# EAGLE board untitled (EAGLE 9.6.2), part 1 of 2
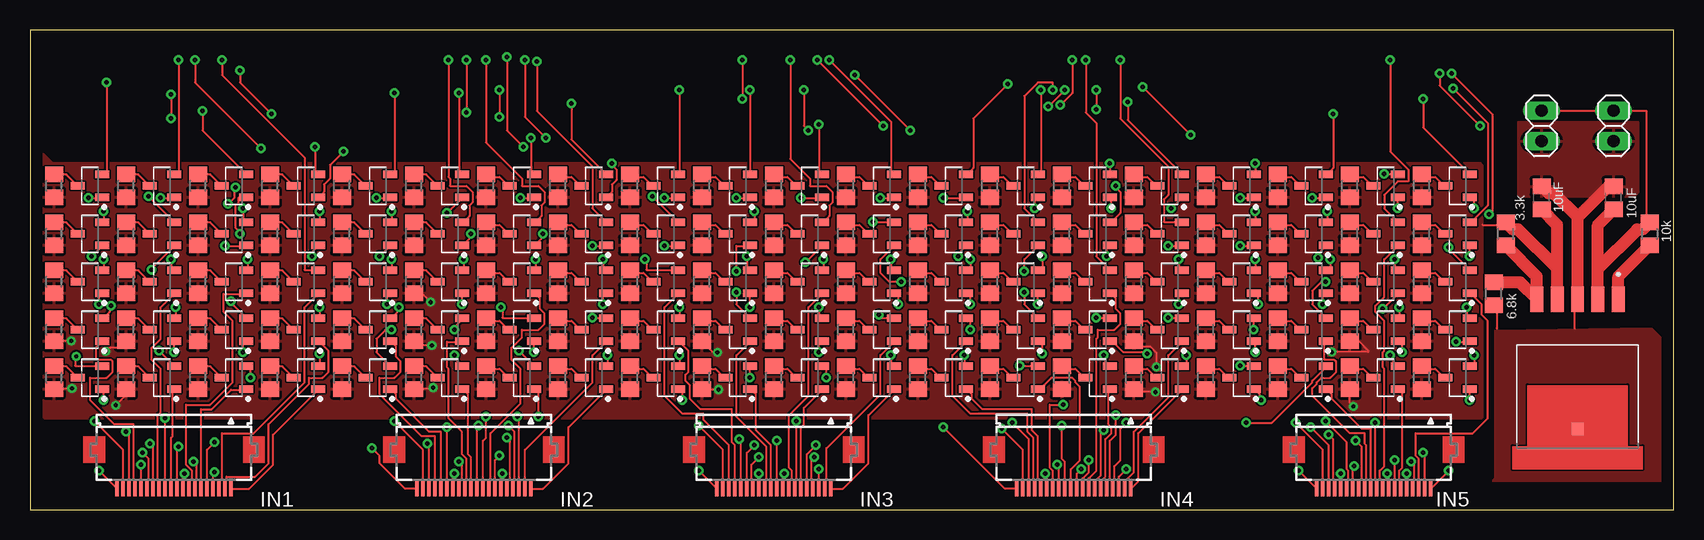
[diagram p1: board, top side]
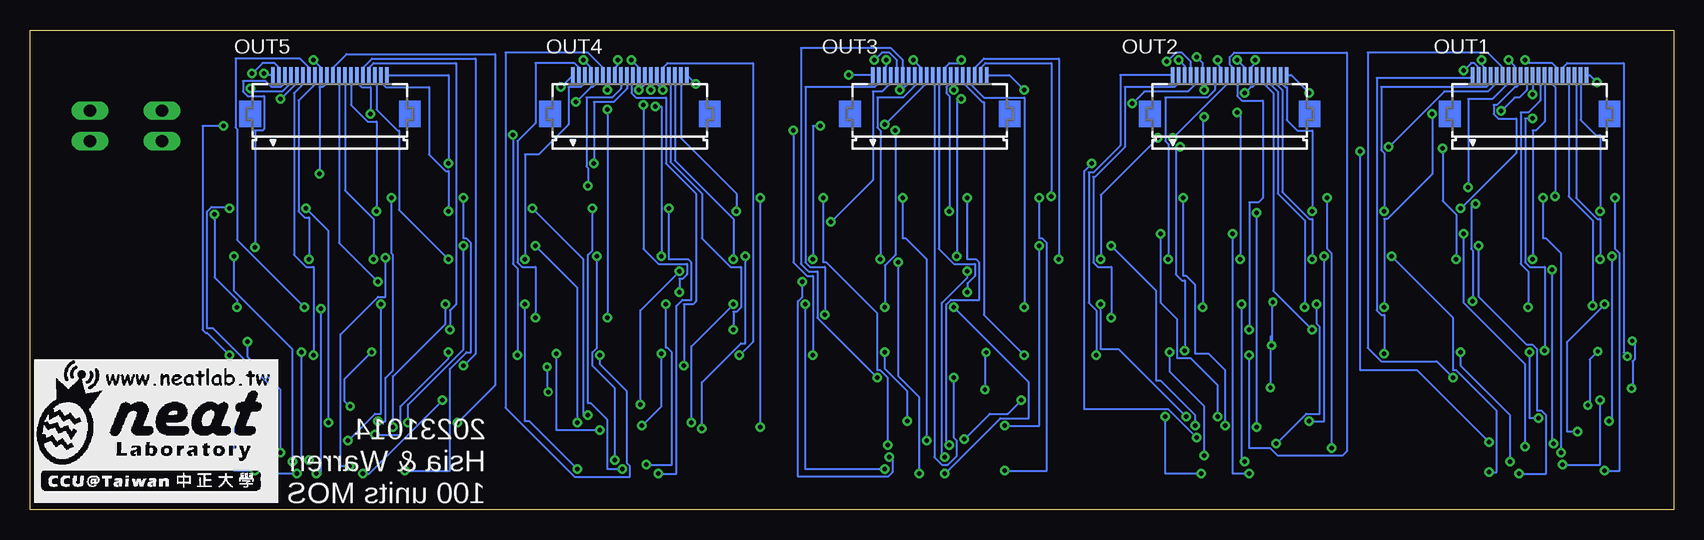
[diagram p2: board, bottom side, seen from below]

Size 137 x 40 mm. Coordinates in mm from the lower left corner, seen from the top.
Outline: 0,0 137,0 137,40 0,40 0,0
Copper layers (1*16): Top 0.035mm / dielectric 1.5mm / Bottom 0.035mm
Design rules "default": minimum track width 6mil, minimum drill 0.35mm, track to track 6mil, track to pad 6mil, pad to pad 6mil, via to via 6mil, smd to smd 6mil, copper to edge 40mil, drill to drill 6mil, minimum pad ring 10mil, minimum via ring 8mil, stop-mask expansion 4mil, vias tented up to drill 0mil, thermal gap 10mil

## Footprints (pad centres in the part's own frame; a part is rotated, then mirrored left to right if it is on the bottom)
FH12-20S-0.5SH = smd 0.3 x 1.3: 1 -4.75,3.25; 2 -4.25,3.25; 3 -3.75,3.25; 4 -3.25,3.25; 5 -2.75,3.25; 6 -2.25,3.25; 7 -1.75,3.25; 8 -1.25,3.25; 9 -0.75,3.25; 10 -0.25,3.25; 11 0.25,3.25; 12 0.75,3.25; 13 1.25,3.25; 14 1.75,3.25; 15 2.25,3.25; 16 2.75,3.25; 17 3.25,3.25; 18 3.75,3.25; 19 4.25,3.25; 20 4.75,3.25
1X02 = drill 1.016 long: 1 -1.27,0; 2 1.27,0
LP38501TS_ADJ = smd 2.16 x 1.07: ADJ -6.545,-3.4; EN -6.545,3.4; GND -6.545,0; IN -6.545,1.7; OUT -6.545,-1.7 | smd 1 x 1: DAP 4.255,0
C0805 = smd 1.3 x 1.5: 1 -0.95,0; 2 0.95,0
R0805 = smd 1.3 x 1.5: 1 -0.95,0; 2 0.95,0
SOT95P240X110-3N = smd 1.18 x 0.609: 1 -1.024,0.95; 2 -1.024,-0.95; 3 1.024,0

## Placement (x,y rotation side)
IN1  FH12-20S-0.5SH  [FH12-20S-0.5SH]  12,5 180 top
IN2  FH12-20S-0.5SH  [FH12-20S-0.5SH]  37,5 180 top
IN3  FH12-20S-0.5SH  [FH12-20S-0.5SH]  62,5 180 top
IN4  FH12-20S-0.5SH  [FH12-20S-0.5SH]  87,5 180 top
IN5  FH12-20S-0.5SH  [FH12-20S-0.5SH]  112,5 180 top
JP1  [1X02]  126,32 270 top
JP2  [1X02]  132,32 270 top
LDO  [LP38501TS_ADJ]  129,11 270 top
LDO_C1  10uF  [C0805]  132,26 90 top
LDO_C2  10uF  [C0805]  126,26 90 top
LDO_R1  3.3k  [R0805]  123,23 90 top
LDO_R2  6.8k  [R0805]  122,18 90 top
LDO_R3  10k  [R0805]  135,23 270 top
MOS1  NX6008NBKNX6008NBK  [SOT95P240X110-3N]  23,11 180 top
MOS2  NX6008NBKNX6008NBK  [SOT95P240X110-3N]  23,15 180 top
MOS3  NX6008NBKNX6008NBK  [SOT95P240X110-3N]  23,19 180 top
MOS4  NX6008NBKNX6008NBK  [SOT95P240X110-3N]  23,23 180 top
MOS5  NX6008NBKNX6008NBK  [SOT95P240X110-3N]  23,27 180 top
MOS6  NX6008NBKNX6008NBK  [SOT95P240X110-3N]  17,11 180 top
MOS7  NX6008NBKNX6008NBK  [SOT95P240X110-3N]  17,15 180 top
MOS8  NX6008NBKNX6008NBK  [SOT95P240X110-3N]  17,19 180 top
MOS9  NX6008NBKNX6008NBK  [SOT95P240X110-3N]  17,23 180 top
MOS10  NX6008NBKNX6008NBK  [SOT95P240X110-3N]  17,27 180 top
MOS11  NX6008NBKNX6008NBK  [SOT95P240X110-3N]  11,11 180 top
MOS12  NX6008NBKNX6008NBK  [SOT95P240X110-3N]  11,15 180 top
MOS13  NX6008NBKNX6008NBK  [SOT95P240X110-3N]  11,19 180 top
MOS14  NX6008NBKNX6008NBK  [SOT95P240X110-3N]  11,23 180 top
MOS15  NX6008NBKNX6008NBK  [SOT95P240X110-3N]  11,27 180 top
MOS16  NX6008NBKNX6008NBK  [SOT95P240X110-3N]  5,11 180 top
MOS17  NX6008NBKNX6008NBK  [SOT95P240X110-3N]  5,15 180 top
MOS18  NX6008NBKNX6008NBK  [SOT95P240X110-3N]  5,19 180 top
MOS19  NX6008NBKNX6008NBK  [SOT95P240X110-3N]  5,23 180 top
MOS20  NX6008NBKNX6008NBK  [SOT95P240X110-3N]  5,27 180 top
MOS21  NX6008NBKNX6008NBK  [SOT95P240X110-3N]  47,11 180 top
MOS22  NX6008NBKNX6008NBK  [SOT95P240X110-3N]  47,15 180 top
MOS23  NX6008NBKNX6008NBK  [SOT95P240X110-3N]  47,19 180 top
MOS24  NX6008NBKNX6008NBK  [SOT95P240X110-3N]  47,23 180 top
MOS25  NX6008NBKNX6008NBK  [SOT95P240X110-3N]  47,27 180 top
MOS26  NX6008NBKNX6008NBK  [SOT95P240X110-3N]  41,11 180 top
MOS27  NX6008NBKNX6008NBK  [SOT95P240X110-3N]  41,15 180 top
MOS28  NX6008NBKNX6008NBK  [SOT95P240X110-3N]  41,19 180 top
MOS29  NX6008NBKNX6008NBK  [SOT95P240X110-3N]  41,23 180 top
MOS30  NX6008NBKNX6008NBK  [SOT95P240X110-3N]  41,27 180 top
MOS31  NX6008NBKNX6008NBK  [SOT95P240X110-3N]  35,11 180 top
MOS32  NX6008NBKNX6008NBK  [SOT95P240X110-3N]  35,15 180 top
MOS33  NX6008NBKNX6008NBK  [SOT95P240X110-3N]  35,19 180 top
MOS34  NX6008NBKNX6008NBK  [SOT95P240X110-3N]  35,23 180 top
MOS35  NX6008NBKNX6008NBK  [SOT95P240X110-3N]  35,27 180 top
MOS36  NX6008NBKNX6008NBK  [SOT95P240X110-3N]  29,11 180 top
MOS37  NX6008NBKNX6008NBK  [SOT95P240X110-3N]  29,15 180 top
MOS38  NX6008NBKNX6008NBK  [SOT95P240X110-3N]  29,19 180 top
MOS39  NX6008NBKNX6008NBK  [SOT95P240X110-3N]  29,23 180 top
MOS40  NX6008NBKNX6008NBK  [SOT95P240X110-3N]  29,27 180 top
MOS41  NX6008NBKNX6008NBK  [SOT95P240X110-3N]  71,11 180 top
MOS42  NX6008NBKNX6008NBK  [SOT95P240X110-3N]  71,15 180 top
MOS43  NX6008NBKNX6008NBK  [SOT95P240X110-3N]  71,19 180 top
MOS44  NX6008NBKNX6008NBK  [SOT95P240X110-3N]  71,23 180 top
MOS45  NX6008NBKNX6008NBK  [SOT95P240X110-3N]  71,27 180 top
MOS46  NX6008NBKNX6008NBK  [SOT95P240X110-3N]  65,11 180 top
MOS47  NX6008NBKNX6008NBK  [SOT95P240X110-3N]  65,15 180 top
MOS48  NX6008NBKNX6008NBK  [SOT95P240X110-3N]  65,19 180 top
MOS49  NX6008NBKNX6008NBK  [SOT95P240X110-3N]  65,23 180 top
MOS50  NX6008NBKNX6008NBK  [SOT95P240X110-3N]  65,27 180 top
MOS51  NX6008NBKNX6008NBK  [SOT95P240X110-3N]  59,11 180 top
MOS52  NX6008NBKNX6008NBK  [SOT95P240X110-3N]  59,15 180 top
MOS53  NX6008NBKNX6008NBK  [SOT95P240X110-3N]  59,19 180 top
MOS54  NX6008NBKNX6008NBK  [SOT95P240X110-3N]  59,23 180 top
MOS55  NX6008NBKNX6008NBK  [SOT95P240X110-3N]  59,27 180 top
MOS56  NX6008NBKNX6008NBK  [SOT95P240X110-3N]  53,11 180 top
MOS57  NX6008NBKNX6008NBK  [SOT95P240X110-3N]  53,15 180 top
MOS58  NX6008NBKNX6008NBK  [SOT95P240X110-3N]  53,19 180 top
MOS59  NX6008NBKNX6008NBK  [SOT95P240X110-3N]  53,23 180 top
MOS60  NX6008NBKNX6008NBK  [SOT95P240X110-3N]  53,27 180 top
MOS61  NX6008NBKNX6008NBK  [SOT95P240X110-3N]  95,11 180 top
MOS62  NX6008NBKNX6008NBK  [SOT95P240X110-3N]  95,15 180 top
MOS63  NX6008NBKNX6008NBK  [SOT95P240X110-3N]  95,19 180 top
MOS64  NX6008NBKNX6008NBK  [SOT95P240X110-3N]  95,23 180 top
MOS65  NX6008NBKNX6008NBK  [SOT95P240X110-3N]  95,27 180 top
MOS66  NX6008NBKNX6008NBK  [SOT95P240X110-3N]  89,11 180 top
MOS67  NX6008NBKNX6008NBK  [SOT95P240X110-3N]  89,15 180 top
MOS68  NX6008NBKNX6008NBK  [SOT95P240X110-3N]  89,19 180 top
MOS69  NX6008NBKNX6008NBK  [SOT95P240X110-3N]  89,23 180 top
MOS70  NX6008NBKNX6008NBK  [SOT95P240X110-3N]  89,27 180 top
MOS71  NX6008NBKNX6008NBK  [SOT95P240X110-3N]  83,11 180 top
MOS72  NX6008NBKNX6008NBK  [SOT95P240X110-3N]  83,15 180 top
MOS73  NX6008NBKNX6008NBK  [SOT95P240X110-3N]  83,19 180 top
MOS74  NX6008NBKNX6008NBK  [SOT95P240X110-3N]  83,23 180 top
MOS75  NX6008NBKNX6008NBK  [SOT95P240X110-3N]  83,27 180 top
MOS76  NX6008NBKNX6008NBK  [SOT95P240X110-3N]  77,11 180 top
MOS77  NX6008NBKNX6008NBK  [SOT95P240X110-3N]  77,15 180 top
MOS78  NX6008NBKNX6008NBK  [SOT95P240X110-3N]  77,19 180 top
MOS79  NX6008NBKNX6008NBK  [SOT95P240X110-3N]  77,23 180 top
MOS80  NX6008NBKNX6008NBK  [SOT95P240X110-3N]  77,27 180 top
MOS81  NX6008NBKNX6008NBK  [SOT95P240X110-3N]  119,11 180 top
MOS82  NX6008NBKNX6008NBK  [SOT95P240X110-3N]  119,15 180 top
MOS83  NX6008NBKNX6008NBK  [SOT95P240X110-3N]  119,19 180 top
MOS84  NX6008NBKNX6008NBK  [SOT95P240X110-3N]  119,23 180 top
MOS85  NX6008NBKNX6008NBK  [SOT95P240X110-3N]  119,27 180 top
MOS86  NX6008NBKNX6008NBK  [SOT95P240X110-3N]  113,11 180 top
MOS87  NX6008NBKNX6008NBK  [SOT95P240X110-3N]  113,15 180 top
MOS88  NX6008NBKNX6008NBK  [SOT95P240X110-3N]  113,19 180 top
MOS89  NX6008NBKNX6008NBK  [SOT95P240X110-3N]  113,23 180 top
MOS90  NX6008NBKNX6008NBK  [SOT95P240X110-3N]  113,27 180 top
MOS91  NX6008NBKNX6008NBK  [SOT95P240X110-3N]  107,11 180 top
MOS92  NX6008NBKNX6008NBK  [SOT95P240X110-3N]  107,15 180 top
MOS93  NX6008NBKNX6008NBK  [SOT95P240X110-3N]  107,19 180 top
MOS94  NX6008NBKNX6008NBK  [SOT95P240X110-3N]  107,23 180 top
MOS95  NX6008NBKNX6008NBK  [SOT95P240X110-3N]  107,27 180 top
MOS96  NX6008NBKNX6008NBK  [SOT95P240X110-3N]  101,11 180 top
MOS97  NX6008NBKNX6008NBK  [SOT95P240X110-3N]  101,15 180 top
MOS98  NX6008NBKNX6008NBK  [SOT95P240X110-3N]  101,19 180 top
MOS99  NX6008NBKNX6008NBK  [SOT95P240X110-3N]  101,23 180 top
MOS100  NX6008NBKNX6008NBK  [SOT95P240X110-3N]  101,27 180 top
OUT1  FH12-20S-0.5SH  [FH12-20S-0.5SH]  12,33 0 bottom
OUT2  FH12-20S-0.5SH  [FH12-20S-0.5SH]  37,33 0 bottom
OUT3  FH12-20S-0.5SH  [FH12-20S-0.5SH]  62,33 0 bottom
OUT4  FH12-20S-0.5SH  [FH12-20S-0.5SH]  87,33 0 bottom
OUT5  FH12-20S-0.5SH  [FH12-20S-0.5SH]  112,33 0 bottom
R1  0  [R0805]  20,11 90 top
R2  0  [R0805]  20,15 90 top
R3  0  [R0805]  20,19 90 top
R4  0  [R0805]  20,23 90 top
R5  0  [R0805]  20,27 90 top
R6  0  [R0805]  14,11 90 top
R7  0  [R0805]  14,15 90 top
R8  0  [R0805]  14,19 90 top
R9  0  [R0805]  14,23 90 top
R10  0  [R0805]  14,27 90 top
R11  0  [R0805]  8,11 90 top
R12  0  [R0805]  8,15 90 top
R13  0  [R0805]  8,19 90 top
R14  0  [R0805]  8,23 90 top
R15  0  [R0805]  8,27 90 top
R16  0  [R0805]  2,11 90 top
R17  0  [R0805]  2,15 90 top
R18  0  [R0805]  2,19 90 top
R19  0  [R0805]  2,23 90 top
R20  0  [R0805]  2,27 90 top
R21  0  [R0805]  44,11 90 top
R22  0  [R0805]  44,15 90 top
R23  0  [R0805]  44,19 90 top
R24  0  [R0805]  44,23 90 top
R25  0  [R0805]  44,27 90 top
R26  0  [R0805]  38,11 90 top
R27  0  [R0805]  38,15 90 top
R28  0  [R0805]  38,19 90 top
R29  0  [R0805]  38,23 90 top
R30  0  [R0805]  38,27 90 top
R31  0  [R0805]  32,11 90 top
R32  0  [R0805]  32,15 90 top
R33  0  [R0805]  32,19 90 top
R34  0  [R0805]  32,23 90 top
R35  0  [R0805]  32,27 90 top
R36  0  [R0805]  26,11 90 top
R37  0  [R0805]  26,15 90 top
R38  0  [R0805]  26,19 90 top
R39  0  [R0805]  26,23 90 top
R40  0  [R0805]  26,27 90 top
R41  0  [R0805]  68,11 90 top
R42  0  [R0805]  68,15 90 top
R43  0  [R0805]  68,19 90 top
R44  0  [R0805]  68,23 90 top
R45  0  [R0805]  68,27 90 top
R46  0  [R0805]  62,11 90 top
R47  0  [R0805]  62,15 90 top
R48  0  [R0805]  62,19 90 top
R49  0  [R0805]  62,23 90 top
R50  0  [R0805]  62,27 90 top
R51  0  [R0805]  56,11 90 top
R52  0  [R0805]  56,15 90 top
R53  0  [R0805]  56,19 90 top
R54  0  [R0805]  56,23 90 top
R55  0  [R0805]  56,27 90 top
R56  0  [R0805]  50,11 90 top
R57  0  [R0805]  50,15 90 top
R58  0  [R0805]  50,19 90 top
R59  0  [R0805]  50,23 90 top
R60  0  [R0805]  50,27 90 top
R61  0  [R0805]  92,11 90 top
R62  0  [R0805]  92,15 90 top
R63  0  [R0805]  92,19 90 top
R64  0  [R0805]  92,23 90 top
R65  0  [R0805]  92,27 90 top
R66  0  [R0805]  86,11 90 top
R67  0  [R0805]  86,15 90 top
R68  0  [R0805]  86,19 90 top
R69  0  [R0805]  86,23 90 top
R70  0  [R0805]  86,27 90 top
R71  0  [R0805]  80,11 90 top
R72  0  [R0805]  80,15 90 top
R73  0  [R0805]  80,19 90 top
R74  0  [R0805]  80,23 90 top
R75  0  [R0805]  80,27 90 top
R76  0  [R0805]  74,11 90 top
R77  0  [R0805]  74,15 90 top
R78  0  [R0805]  74,19 90 top
R79  0  [R0805]  74,23 90 top
R80  0  [R0805]  74,27 90 top
R81  0  [R0805]  116,11 90 top
R82  0  [R0805]  116,15 90 top
R83  0  [R0805]  116,19 90 top
R84  0  [R0805]  116,23 90 top
R85  0  [R0805]  116,27 90 top
R86  0  [R0805]  110,11 90 top
R87  0  [R0805]  110,15 90 top
R88  0  [R0805]  110,19 90 top
R89  0  [R0805]  110,23 90 top
R90  0  [R0805]  110,27 90 top
R91  0  [R0805]  104,11 90 top
R92  0  [R0805]  104,15 90 top
R93  0  [R0805]  104,19 90 top
R94  0  [R0805]  104,23 90 top
R95  0  [R0805]  104,27 90 top
R96  0  [R0805]  98,11 90 top
R97  0  [R0805]  98,15 90 top
R98  0  [R0805]  98,19 90 top
R99  0  [R0805]  98,23 90 top
R100  0  [R0805]  98,27 90 top
U$1  [LOGO_SCALE_2.0]  136.6,0.6 0 bottom